# Altium schematic sheet msp432.SchDoc
size Letter
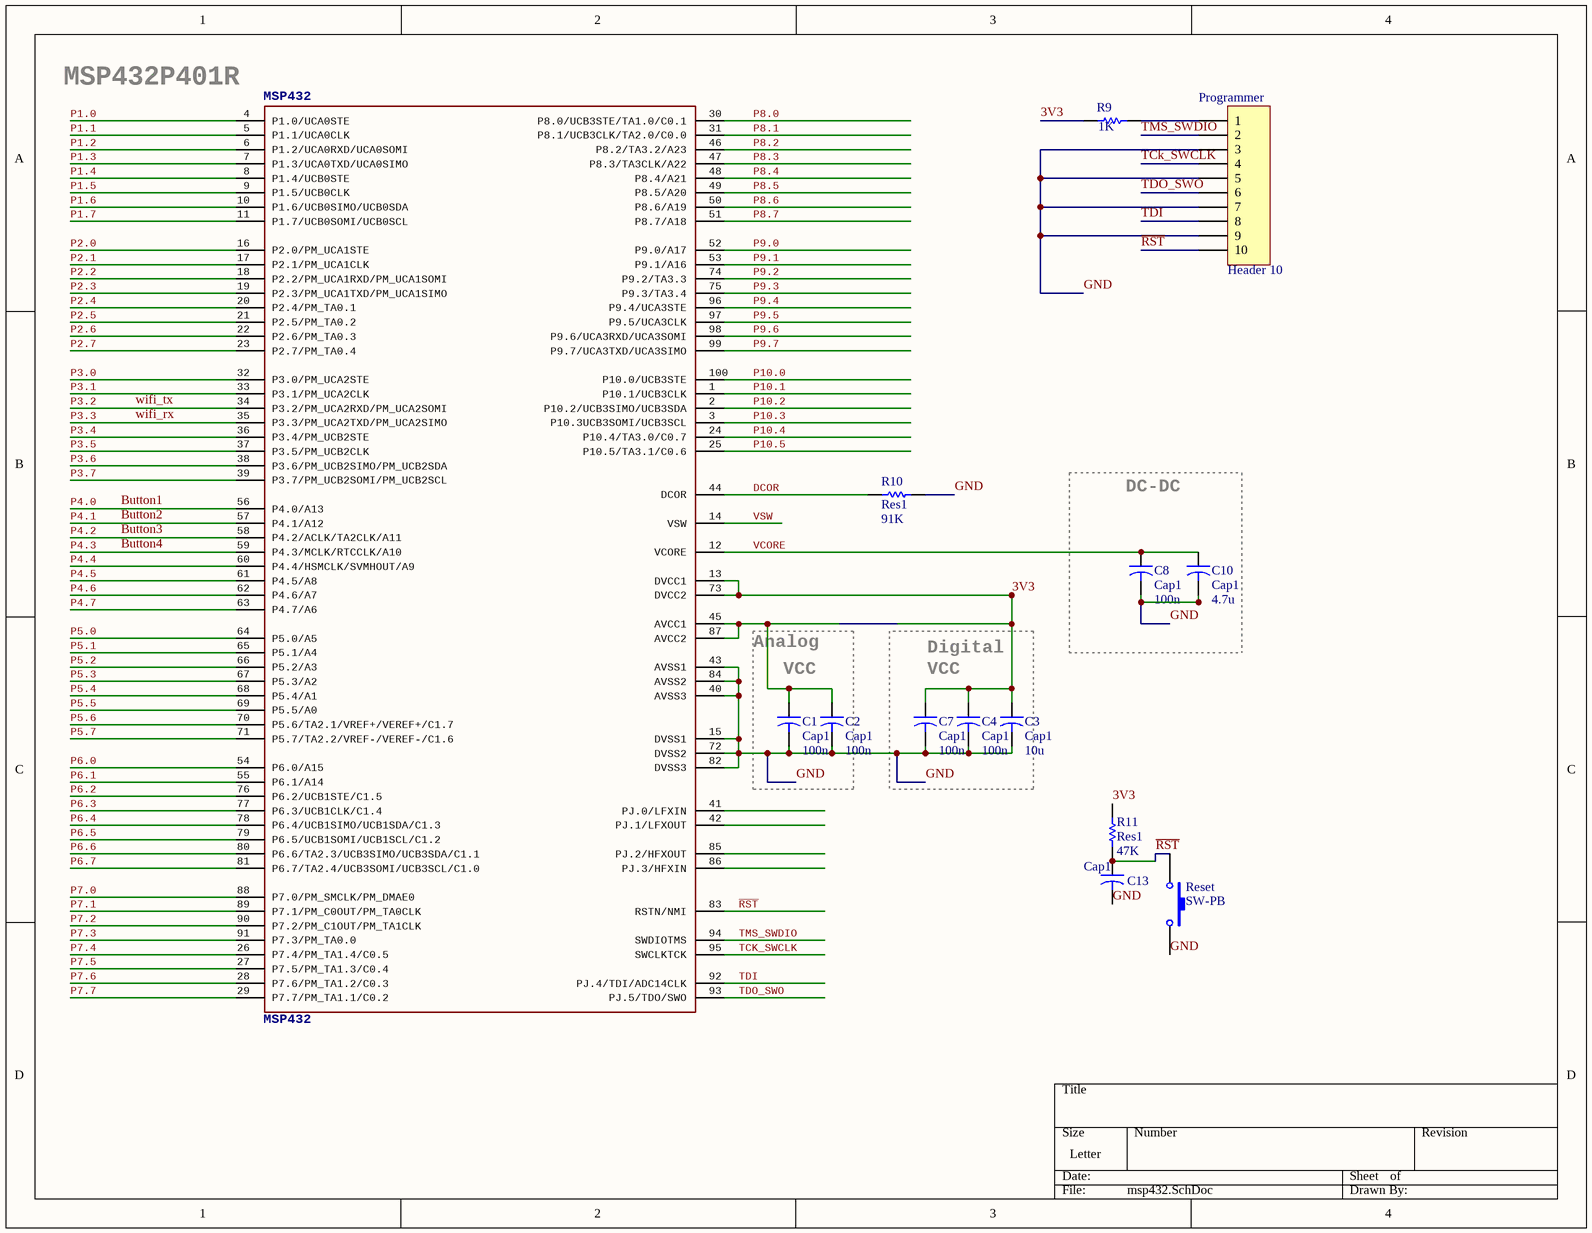
[diagram p0: msp432.SchDoc]

## Parts
C1  Cap1  value 100n  [CAPR5-4X5]
C2  Cap1  value 100n  [CAPR5-4X5]
C3  Cap1  value 10u  [CAPR5-4X5]
C4  Cap1  value 100n  [CAPR5-4X5]
C7  Cap1  value 100n  [CAPR5-4X5]
C8  Cap1  value 100n  [CAPR5-4X5]
C10  Cap1  value 4.7u  [CAPR5-4X5]
C13  Cap1  [CAPR5-4X5]
MSP432  MSP432  [PZ100_L]
Programmer  Header 10  [HDR1X10]
R9  value 1K  [AXIAL-0.3]  (hidden comment: Res1)
R10  Res1  value 91K  [AXIAL-0.3]
R11  Res1  value 47K  [AXIAL-0.3]
Reset  SW-PB  [SW PB]

## Blocks framed on the sheet
DC-DC: C8 C10

## Nets
3V3: C1.1 C2.1 C3.1 C4.1 C7.1 MSP432.13(DVCC1) MSP432.45(AVCC1) MSP432.73(DVCC2) MSP432.87(AVCC2) R9.1 R11.2
Button1: MSP432.56(P4.0/A13)  [also labelled P4.0]
Button2: MSP432.57(P4.1/A12)  [also labelled P4.1]
Button3: MSP432.58(P4.2/ACLK/TA2CLK/A11)  [also labelled P4.2]
Button4: MSP432.59(P4.3/MCLK/RTCCLK/A10)  [also labelled P4.3]
DCOR: MSP432.44(DCOR) R10.1
GND: C1.2 C2.2 C3.2 C4.2 C7.2 C8.2 C10.2 C13.2 MSP432.15(DVSS1) MSP432.40(AVSS3) MSP432.43(AVSS1) MSP432.72(DVSS2) MSP432.82(DVSS3) MSP432.84(AVSS2) Programmer.3 Programmer.5 Programmer.7 Programmer.9 R10.2 Reset.2
P1.0: MSP432.4(P1.0/UCA0STE)
P1.1: MSP432.5(P1.1/UCA0CLK)
P1.2: MSP432.6(P1.2/UCA0RXD/UCA0SOMI)
P1.3: MSP432.7(P1.3/UCA0TXD/UCA0SIMO)
P1.4: MSP432.8(P1.4/UCB0STE)
P1.5: MSP432.9(P1.5/UCB0CLK)
P1.6: MSP432.10(P1.6/UCB0SIMO/UCB0SDA)
P1.7: MSP432.11(P1.7/UCB0SOMI/UCB0SCL)
P2.0: MSP432.16(P2.0/PM_UCA1STE)
P2.1: MSP432.17(P2.1/PM_UCA1CLK)
P2.2: MSP432.18(P2.2/PM_UCA1RXD/PM_UCA1SOMI)
P2.3: MSP432.19(P2.3/PM_UCA1TXD/PM_UCA1SIMO)
P2.4: MSP432.20(P2.4/PM_TA0.1)
P2.5: MSP432.21(P2.5/PM_TA0.2)
P2.6: MSP432.22(P2.6/PM_TA0.3)
P2.7: MSP432.23(P2.7/PM_TA0.4)
P3.0: MSP432.32(P3.0/PM_UCA2STE)
P3.1: MSP432.33(P3.1/PM_UCA2CLK)
P3.2: MSP432.34(P3.2/PM_UCA2RXD/PM_UCA2SOMI)  [also labelled wifi_tx]
P3.3: MSP432.35(P3.3/PM_UCA2TXD/PM_UCA2SIMO)  [also labelled wifi_rx]
P3.4: MSP432.36(P3.4/PM_UCB2STE)
P3.5: MSP432.37(P3.5/PM_UCB2CLK)
P3.6: MSP432.38(P3.6/PM_UCB2SIMO/PM_UCB2SDA)
P3.7: MSP432.39(P3.7/PM_UCB2SOMI/PM_UCB2SCL)
P4.4: MSP432.60(P4.4/HSMCLK/SVMHOUT/A9)
P4.5: MSP432.61(P4.5/A8)
P4.6: MSP432.62(P4.6/A7)
P4.7: MSP432.63(P4.7/A6)
P5.0: MSP432.64(P5.0/A5)
P5.1: MSP432.65(P5.1/A4)
P5.2: MSP432.66(P5.2/A3)
P5.3: MSP432.67(P5.3/A2)
P5.4: MSP432.68(P5.4/A1)
P5.5: MSP432.69(P5.5/A0)
P5.6: MSP432.70(P5.6/TA2.1/VREF+/VEREF+/C1.7)
P5.7: MSP432.71(P5.7/TA2.2/VREF-/VEREF-/C1.6)
P6.0: MSP432.54(P6.0/A15)
P6.1: MSP432.55(P6.1/A14)
P6.2: MSP432.76(P6.2/UCB1STE/C1.5)
P6.3: MSP432.77(P6.3/UCB1CLK/C1.4)
P6.4: MSP432.78(P6.4/UCB1SIMO/UCB1SDA/C1.3)
P6.5: MSP432.79(P6.5/UCB1SOMI/UCB1SCL/C1.2)
P6.6: MSP432.80(P6.6/TA2.3/UCB3SIMO/UCB3SDA/C1.1)
P6.7: MSP432.81(P6.7/TA2.4/UCB3SOMI/UCB3SCL/C1.0)
P7.0: MSP432.88(P7.0/PM_SMCLK/PM_DMAE0)
P7.1: MSP432.89(P7.1/PM_C0OUT/PM_TA0CLK)
P7.2: MSP432.90(P7.2/PM_C1OUT/PM_TA1CLK)
P7.3: MSP432.91(P7.3/PM_TA0.0)
P7.4: MSP432.26(P7.4/PM_TA1.4/C0.5)
P7.5: MSP432.27(P7.5/PM_TA1.3/C0.4)
P7.6: MSP432.28(P7.6/PM_TA1.2/C0.3)
P7.7: MSP432.29(P7.7/PM_TA1.1/C0.2)
P8.0: MSP432.30(P8.0/UCB3STE/TA1.0/C0.1)
P8.1: MSP432.31(P8.1/UCB3CLK/TA2.0/C0.0)
P8.2: MSP432.46(P8.2/TA3.2/A23)
P8.3: MSP432.47(P8.3/TA3CLK/A22)
P8.4: MSP432.48(P8.4/A21)
P8.5: MSP432.49(P8.5/A20)
P8.6: MSP432.50(P8.6/A19)
P8.7: MSP432.51(P8.7/A18)
P9.0: MSP432.52(P9.0/A17)
P9.1: MSP432.53(P9.1/A16)
P9.2: MSP432.74(P9.2/TA3.3)
P9.3: MSP432.75(P9.3/TA3.4)
P9.4: MSP432.96(P9.4/UCA3STE)
P9.5: MSP432.97(P9.5/UCA3CLK)
P9.6: MSP432.98(P9.6/UCA3RXD/UCA3SOMI)
P9.7: MSP432.99(P9.7/UCA3TXD/UCA3SIMO)
P10.0: MSP432.100(P10.0/UCB3STE)
P10.1: MSP432.1(P10.1/UCB3CLK)
P10.2: MSP432.2(P10.2/UCB3SIMO/UCB3SDA)
P10.3: MSP432.3(P10.3UCB3SOMI/UCB3SCL)
P10.4: MSP432.24(P10.4/TA3.0/C0.7)
P10.5: MSP432.25(P10.5/TA3.1/C0.6)
~{RST}: C13.1 MSP432.83(RSTN/NMI) Programmer.10 R11.1 Reset.1
TCK_SWCLK: MSP432.95(SWCLKTCK) Programmer.4
TDI: MSP432.92(PJ.4/TDI/ADC14CLK) Programmer.8
TDO_SWO: MSP432.93(PJ.5/TDO/SWO) Programmer.6
TMS_SWDIO: MSP432.94(SWDIOTMS) Programmer.2
VCORE: C8.1 C10.1 MSP432.12(VCORE)
VSW: MSP432.14(VSW)
NetProgrammer_1: Programmer.1 R9.2

Not connected (* = marked no-connect by the designer): MSP432 41(PJ.0/LFXIN) 42(PJ.1/LFXOUT) 85(PJ.2/HFXOUT) 86(PJ.3/HFXIN)

## Notes on the sheet
- MSP432P401R
- Analog
- VCC
- Digital

## Library data of the parts
C1-C4 C7 C8 C10 C13 = Cap2: Capacitor; Published: 23-Sep-2002; PackageReference: CAPR5-4X5; Publisher: Altium Limited; PackageDescription: Capacitor; 2 Leads
Programmer = Header 10: Header, 10-Pin; LatestRevisionDate: 17-Jul-2002; LatestRevisionNote: Re-released for DXP Platform.; Publisher: Altium Limited
R9-R11 = Res1: Resistor; Published: 8-Jun-2000; LatestRevisionDate: 17-Jul-2002; LatestRevisionNote: Re-released for DXP Platform.; PackageReference: AXIAL-0.3; Publisher: Altium Limited; PackageDescription: Axial Device, Thru-Hole; 2 Leads; 0.3 in Pin Spacing
Reset = SW-PB_2: DIGIKEY SW400-ND; Published: 24-Mar-1999; LatestRevisionDate: 17-Jul-2002; LatestRevisionNote: Re-released for DXP Platform.; Publisher: Altium Limited